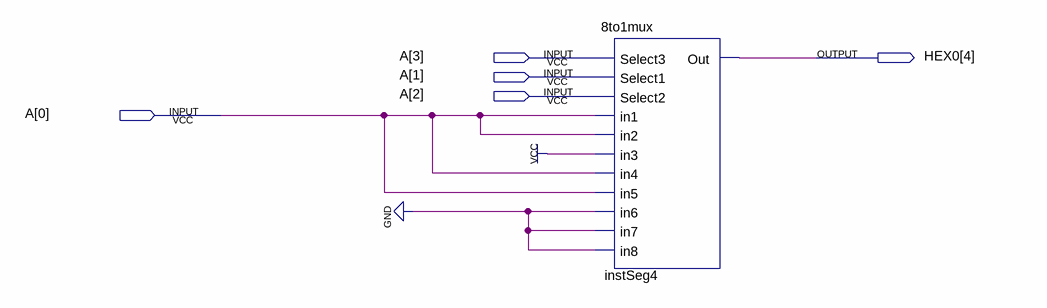
[diagram p0: schematic sheet]
// Quartus schematic seg4.bdf as structural Verilog: 1 symbols, 5 pins
module seg4 (
  input  [3:0] A,
  output [4:4] HEX0
);

  \8to1mux  instSeg4 (
    .Select3(A[3]), .Select1(A[1]), .Select2(A[2]), .in1(A[0]), .in2(A[0]), .in3(1'b1), .in4(A[0]),
    .in5(A[0]), .in6(1'b0), .in7(1'b0), .in8(1'b0), .Out(HEX0[4]));
endmodule
